# Altium schematic sheet MB1430_Top.SchDoc: Top hierarchical view
size A4; Date: Not used; ApprovedBy: Not used; CheckedBy: Not used; Author: Not used; CompanyName: STMicroelectronics; DrawnBy: Not used; Engineer: Not used; Organization: Not used; Address1: Not used; Address2: Not used; Address3: Not used; Address4: Not used; DocumentNumber: Not used; Revision: A-01-P3; SheetNumber: 2; SheetTotal: 7; CurrentTime: Not used; CurrentDate: Not used; Time: Not used; DocumentFullPathAndName: Not used; DocumentName: Not used; ModifiedDate: Not used; ImagePath: Not used; ProjectName: Not used; Application_BuildNumber: Not used
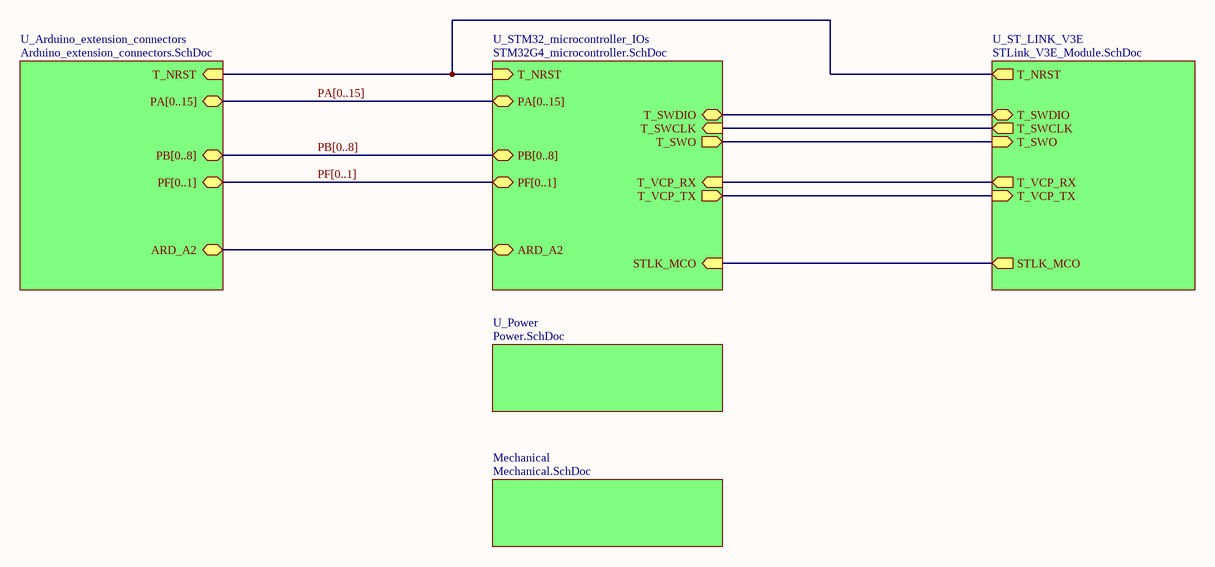
[diagram p0: MB1430_Top.SchDoc]

## Sub-sheets
Mechanical = Mechanical.SchDoc: no entries
U_Arduino_extension_connectors = Arduino_extension_connectors.SchDoc: PA[0..15] (bidir), PF[0..1] (bidir), T_NRST, PB[0..8] (bidir), ARD_A2
U_Power = Power.SchDoc: no entries
U_ST_LINK_V3E = STLink_V3E_Module.SchDoc: T_SWCLK, T_SWO, T_NRST, STLK_MCO, T_SWDIO, T_VCP_TX, T_VCP_RX
U_STM32_microcontroller_IOs = STM32G4_microcontroller.SchDoc: PA[0..15] (bidir), PF[0..1] (bidir), STLK_MCO, T_NRST, T_VCP_TX, T_VCP_RX, T_SWCLK, T_SWO, T_SWDIO, PB[0..8] (bidir), ARD_A2

## Nets
(unnamed): sheet U_Arduino_extension_connectors/T_NRST, sheet U_STM32_microcontroller_IOs/T_NRST, sheet U_ST_LINK_V3E/T_NRST
(unnamed): sheet U_Arduino_extension_connectors/ARD_A2, sheet U_STM32_microcontroller_IOs/ARD_A2
(unnamed): sheet U_STM32_microcontroller_IOs/STLK_MCO, sheet U_ST_LINK_V3E/STLK_MCO
(unnamed): sheet U_STM32_microcontroller_IOs/T_VCP_TX, sheet U_ST_LINK_V3E/T_VCP_TX
(unnamed): sheet U_STM32_microcontroller_IOs/T_VCP_RX, sheet U_ST_LINK_V3E/T_VCP_RX
(unnamed): sheet U_STM32_microcontroller_IOs/T_SWCLK, sheet U_ST_LINK_V3E/T_SWCLK
(unnamed): sheet U_STM32_microcontroller_IOs/T_SWO, sheet U_ST_LINK_V3E/T_SWO
(unnamed): sheet U_STM32_microcontroller_IOs/T_SWDIO, sheet U_ST_LINK_V3E/T_SWDIO

## Buses and harness runs
bus PA[0..15] = sheet U_Arduino_extension_connectors/PA[0..15] = sheet U_STM32_microcontroller_IOs/PA[0..15]
bus PB[0..8] = sheet U_Arduino_extension_connectors/PB[0..8] = sheet U_STM32_microcontroller_IOs/PB[0..8]
bus PF[0..1] = sheet U_Arduino_extension_connectors/PF[0..1] = sheet U_STM32_microcontroller_IOs/PF[0..1]

## Notes on the sheet
- Cuttable part on PCB
- Title:
- Project:
- Size:
- Revision:
- Variant:
- A4
- -
- Date:
- Reference:
- Sheet:
- of